# EAGLE schematic WB-v2.0b (EAGLE 6.1)

## Sheet 1 of 5
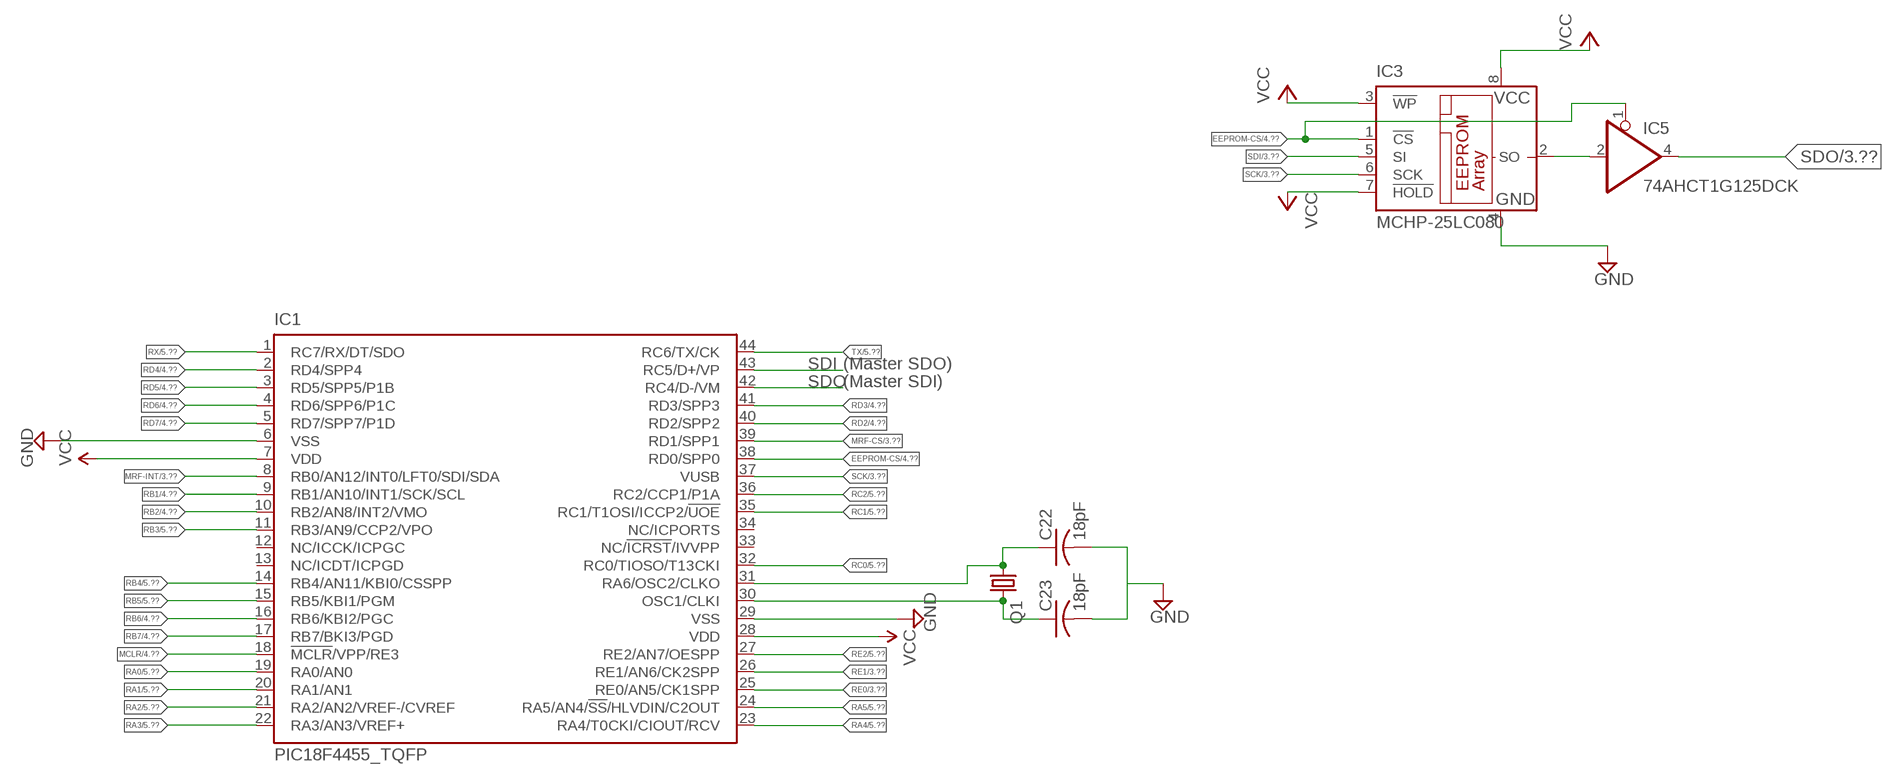
[diagram p0: schematic, sheet 1]

### Parts
C22  18pF  C-USC0402  [C0402]
C23  18pF  C-USC0402  [C0402]
IC1  PIC18F4455_TQFP  [TQFP44]
IC3  MCHP-25LC080  25AA080SN  [SO-08]
IC5  74AHCT1G125DCK  [SC70-5]
Q1  CRYSTALSM49  [SM49]

### Nets
EEPROM-CS: IC1.38(RD0/SPP0) IC3.1(!CS) IC5.1(OE) ; also sheet 4
GND: C22.2 C23.2 IC1.6(VSS) IC1.29(VSS) IC3.4(GND) ; also sheet 3,4,5
MCLR: IC1.18(!MCLR!/VPP/RE3) ; also sheet 4,5
MRF-CS: IC1.39(RD1/SPP1) ; also sheet 3,4
MRF-INT: IC1.8(RB0/AN12/INT0/LFT0/SDI/SDA) ; also sheet 3
N$11: IC3.2(SO) IC5.2(I)
N$12: C23.1 IC1.30(OSC1/CLKI) Q1.2
N$13: C22.1 IC1.31(RA6/OSC2/CLKO) Q1.1
RA0: IC1.19(RA0/AN0) ; also sheet 5
RA1: IC1.20(RA1/AN1) ; also sheet 5
RA2: IC1.21(RA2/AN2/VREF-/CVREF) ; also sheet 5
RA3: IC1.22(RA3/AN3/VREF+) ; also sheet 5
RA4: IC1.23(RA4/T0CKI/CIOUT/RCV) ; also sheet 5
RA5: IC1.24(RA5/AN4/!SS!/HLVDIN/C2OUT) ; also sheet 5
RB1: IC1.9(RB1/AN10/INT1/SCK/SCL) ; also sheet 4,5
RB2: IC1.10(RB2/AN8/INT2/VMO) ; also sheet 4,5
RB3: IC1.11(RB3/AN9/CCP2/VPO) ; also sheet 5
RB4: IC1.14(RB4/AN11/KBI0/CSSPP) ; also sheet 5
RB5: IC1.15(RB5/KBI1/PGM) ; also sheet 5
RB6: IC1.16(RB6/KBI2/PGC) ; also sheet 4,5
RB7: IC1.17(RB7/BKI3/PGD) ; also sheet 4,5
RC0: IC1.32(RC0/TIOSO/T13CKI) ; also sheet 5
RC1: IC1.35(RC1/T1OSI/ICCP2/!UOE) ; also sheet 5
RC2: IC1.36(RC2/CCP1/P1A) ; also sheet 5
RD2: IC1.40(RD2/SPP2) ; also sheet 4,5
RD3: IC1.41(RD3/SPP3) ; also sheet 4,5
RD4: IC1.2(RD4/SPP4) ; also sheet 4,5
RD5: IC1.3(RD5/SPP5/P1B) ; also sheet 4,5
RD6: IC1.4(RD6/SPP6/P1C) ; also sheet 4,5
RD7: IC1.5(RD7/SPP7/P1D) ; also sheet 4,5
RE0: IC1.25(RE0/AN5/CK1SPP) ; also sheet 3,5
RE1: IC1.26(RE1/AN6/CK2SPP) ; also sheet 3,5
RE2: IC1.27(RE2/AN7/OESPP) ; also sheet 5
RX: IC1.1(RC7/RX/DT/SDO) ; also sheet 5
SCK: IC1.37(VUSB) IC3.6(SCK) ; also sheet 3,4
SDI: IC1.43(RC5/D+/VP) IC3.5(SI) ; also sheet 3,4
SDO: IC1.42(RC4/D-/VM) IC5.4(O) ; also sheet 3,4
TX: IC1.44(RC6/TX/CK) ; also sheet 5
VCC: IC1.7(VDD) IC1.28(VDD) IC3.3(!WP) IC3.7(!HOLD) IC3.8(VCC) ; also sheet 3,4,5
Unconnected: IC1.12(NC/ICCK/ICPGC) IC1.13(NC/ICDT/ICPGD) IC1.33(NC/!ICRST!/IVVPP) IC1.34(NC/ICPORTS)

### Notes on the sheet
- (Master SDO)
- (Master SDI)

## Sheet 2 of 5
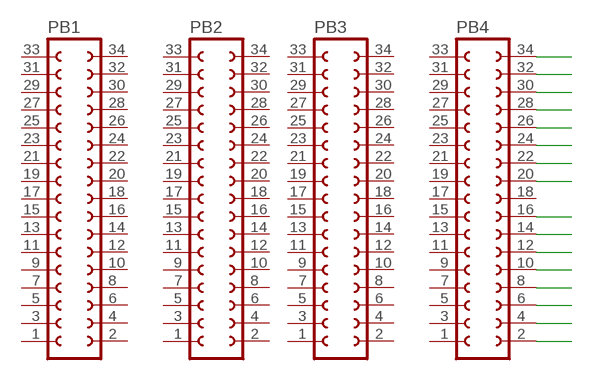
[diagram p1: schematic, sheet 2]

### Parts
PB1  FE17-2  [FE17-2]
PB2  FE17-2  [FE17-2]
PB3  FE17-2  [FE17-2]
PB4  FE17-2  [FE17-2]

### Nets
N$31: PB4.34
N$32: PB4.32
N$33: PB4.30
N$34: PB4.28
N$35: PB4.26
N$36: PB4.24
N$37: PB4.22
N$38: PB4.20
N$39: PB4.2
N$40: PB4.4
N$41: PB4.6
N$42: PB4.8
N$43: PB4.10
N$44: PB4.12
N$45: PB4.14
N$46: PB4.16
Unconnected: PB1.1 PB1.2 PB1.3 PB1.4 PB1.5 PB1.6 PB1.7 PB1.8 PB1.9 PB1.10 PB1.11 PB1.12 PB1.13 PB1.14 PB1.15 PB1.16 PB1.17 PB1.18 PB1.19 PB1.20 PB1.21 PB1.22 PB1.23 PB1.24 PB1.25 PB1.26 PB1.27 PB1.28 PB1.29 PB1.30 PB1.31 PB1.32 PB1.33 PB1.34 PB2.1 PB2.2 PB2.3 PB2.4 PB2.5 PB2.6 PB2.7 PB2.8 PB2.9 PB2.10 PB2.11 PB2.12 PB2.13 PB2.14 PB2.15 PB2.16 PB2.17 PB2.18 PB2.19 PB2.20 PB2.21 PB2.22 PB2.23 PB2.24 PB2.25 PB2.26 PB2.27 PB2.28 PB2.29 PB2.30 PB2.31 PB2.32 PB2.33 PB2.34 PB3.1 PB3.2 PB3.3 PB3.4 PB3.5 PB3.6 PB3.7 PB3.8 PB3.9 PB3.10 PB3.11 PB3.12 PB3.13 PB3.14 PB3.15 PB3.16 PB3.17 PB3.18 PB3.19 PB3.20 PB3.21 PB3.22 PB3.23 PB3.24 PB3.25 PB3.26 PB3.27 PB3.28 PB3.29 PB3.30 PB3.31 PB3.32 PB3.33 PB3.34 PB4.1 PB4.3 PB4.5 PB4.7 PB4.9 PB4.11 PB4.13 PB4.15 PB4.17 PB4.18 PB4.19 PB4.21 PB4.23 PB4.25 PB4.27 PB4.29 PB4.31 PB4.33

## Sheet 3 of 5
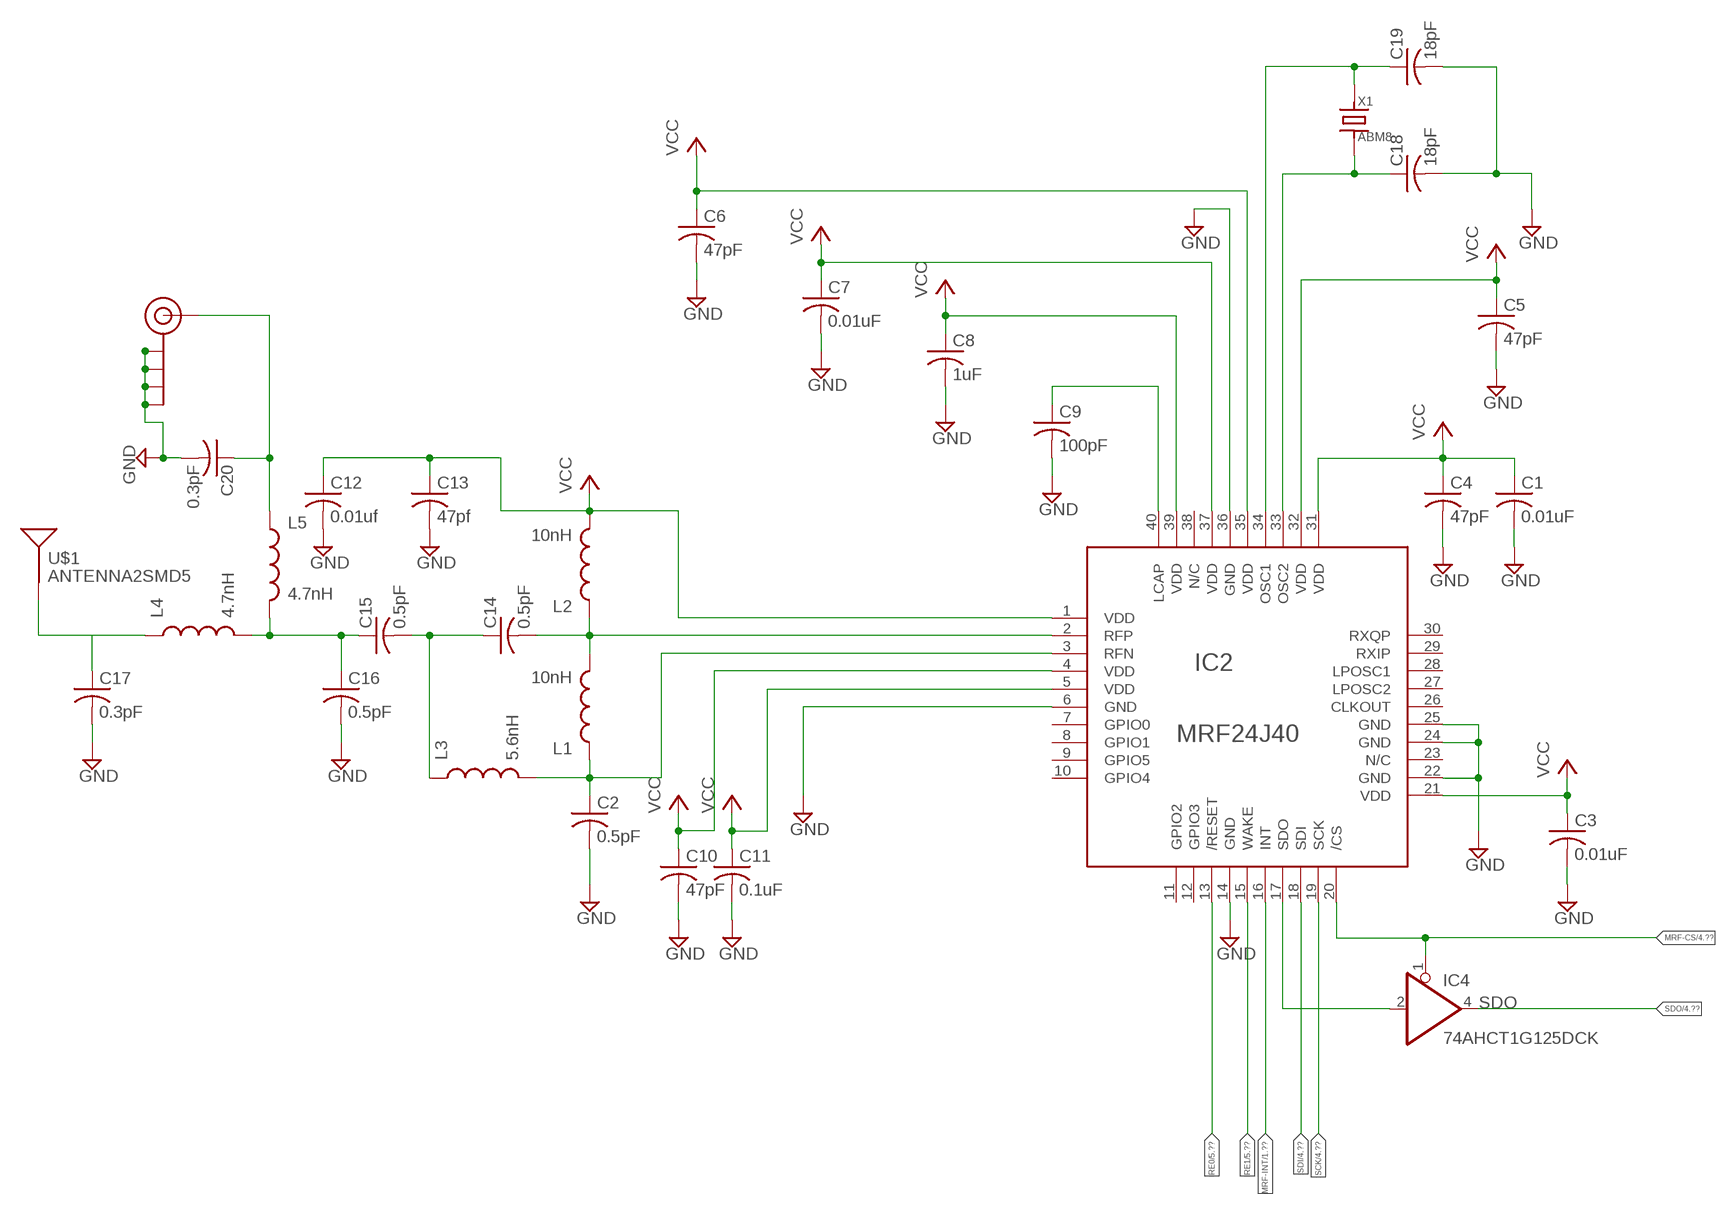
[diagram p2: schematic, sheet 3]

### Parts
C1  0.01uF  C-USC0402  [C0402]
C2  0.5pF  C-USC0402  [C0402]
C3  0.01uF  C-USC0402  [C0402]
C4  47pF  C-USC0402  [C0402]
C5  47pF  C-USC0402  [C0402]
C6  47pF  C-USC0402  [C0402]
C7  0.01uF  C-USC0402  [C0402]
C8  1uF  C-USC0402  [C0402]
C9  100pF  C-USC0402  [C0402]
C10  47pF  C-USC0402  [C0402]
C11  0.1uF  C-USC0402  [C0402]
C12  0.01uf  C-USC0402  [C0402]
C13  47pf  C-USC0402  [C0402]
C14  0.5pF  C-USC0402  [C0402]
C15  0.5pF  C-USC0402  [C0402]
C16  0.5pF  C-USC0402  [C0402]
C17  0.3pF  C-USC0402  [C0402]
C18  18pF  C-USC0402  [C0402]
C19  18pF  C-USC0402  [C0402]
C20  0.3pF  C-USC0402  [C0402]
IC2  MRF24J40  [QFN40]
IC4  74AHCT1G125DCK  [SC70-5]
J$1  SMA_EDGE  [SMA-EDGE]
L1  10nH  INDUCTOR0402  [C0402]
L2  10nH  INDUCTOR0402  [C0402]
L3  5.6nH  INDUCTOR0402  [C0402]
L4  4.7nH  INDUCTOR0402  [C0402]
L5  4.7nH  INDUCTOR0402  [C0402]
U$1  ANTENNA2SMD5  [ANTENNA-CHIP5]
X1  ABM8  [ABM8]

### Nets
GND: C1.2 C2.2 C3.2 C4.2 C5.2 C6.2 C7.2 C8.2 C9.2 C10.2 C11.2 C12.2 C13.2 C16.2 C17.2 C18.2 C19.2 C20.2 IC2.6(GND) IC2.14(GND) IC2.22(GND) IC2.24(GND) IC2.25(GND) IC2.36(GND) J$1.GND@0(GND) J$1.GND@1(GND) J$1.GND@2(GND) J$1.GND@3(GND) ; also sheet 1,4,5
MRF-CS: IC2.20(/CS) IC4.1(OE) ; also sheet 1,4
MRF-INT: IC2.16(INT) ; also sheet 1
N$1: C14.1 C15.2 L3.1
N$2: C2.1 IC2.3(RFN) L1.1 L3.2
N$3: C14.2 IC2.2(RFP) L1.2 L2.1
N$4: C15.1 C16.1 L4.2 L5.2
N$5: C17.1 L4.1 U$1.FEED(SIGNAL)
N$6: C9.1 IC2.40(LCAP)
N$7: C18.1 IC2.33(OSC2) X1.P$1
N$8: C19.1 IC2.34(OSC1) X1.P$3
N$9: C20.1 J$1.SIG(SIGNAL) L5.1
N$10: IC2.17(SDO) IC4.2(I)
RE0: IC2.13(/RESET) ; also sheet 1,5
RE1: IC2.15(WAKE) ; also sheet 1,5
SCK: IC2.19(SCK) ; also sheet 1,4
SDI: IC2.18(SDI) ; also sheet 1,4
SDO: IC4.4(O) ; also sheet 1,4
VCC: C1.1 C3.1 C4.1 C5.1 C6.1 C7.1 C8.1 C10.1 C11.1 C12.1 C13.1 IC2.1(VDD) IC2.4(VDD) IC2.5(VDD) IC2.21(VDD) IC2.31(VDD) IC2.32(VDD) IC2.35(VDD) IC2.37(VDD) IC2.39(VDD) L2.2 ; also sheet 1,4,5
Unconnected: IC2.7(GPIO0) IC2.8(GPIO1) IC2.9(GPIO5) IC2.10(GPIO4) IC2.11(GPIO2) IC2.12(GPIO3) IC2.23(N/C) IC2.26(CLKOUT) IC2.27(LPOSC2) IC2.28(LPOSC1) IC2.29(RXIP) IC2.30(RXQP) IC2.38(N/C)

## Sheet 4 of 5
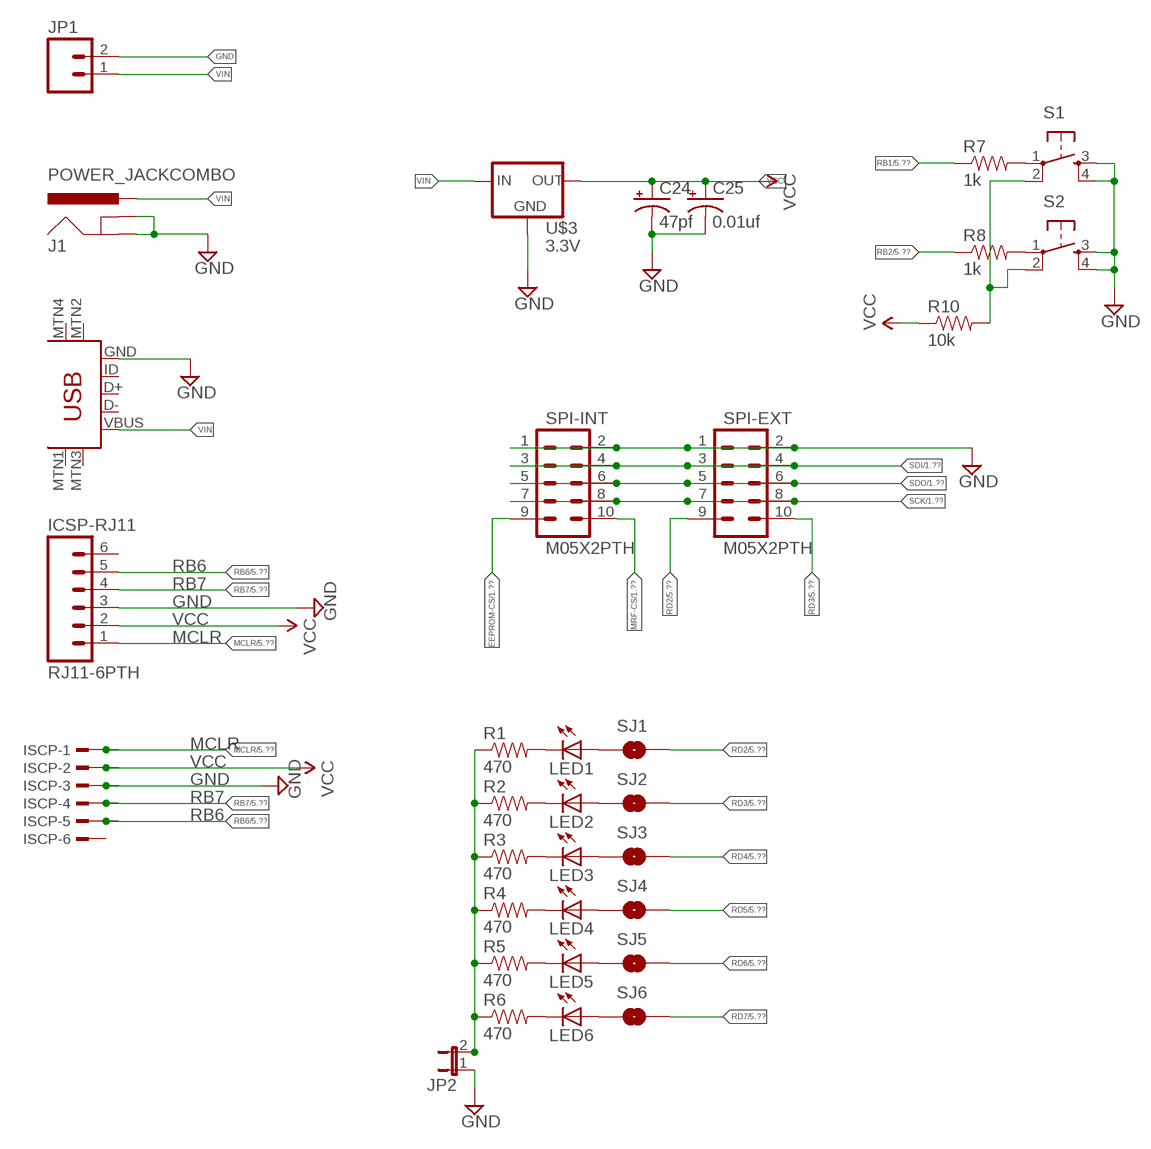
[diagram p3: schematic, sheet 4]

### Parts
C24  47pf  CAP_POLPTH2  [CPOL-RADIAL-10UF-25V]
C25  0.01uf  CAP_POLPTH2  [CPOL-RADIAL-10UF-25V]
ICSP-RJ11  RJ11-6PTH  [RJ11-6]
ISCP  TSW-106-02-S-S  [TSW-106-02-S-S]
J1  POWER_JACKCOMBO  [POWER_JACK_COMBO]
JP1  M02LOCK_LONGPADS  [1X02_LOCK_LONGPADS]
JP2  JUMPER-2PTH  [1X02]
LED1  LED0603  [LED-0603]
LED2  LED0603  [LED-0603]
LED3  LED0603  [LED-0603]
LED4  LED0603  [LED-0603]
LED5  LED0603  [LED-0603]
LED6  LED0603  [LED-0603]
R1  470  RESISTOR0603-RES  [0603-RES]
R2  470  RESISTOR0603-RES  [0603-RES]
R3  470  RESISTOR0603-RES  [0603-RES]
R4  470  RESISTOR0603-RES  [0603-RES]
R5  470  RESISTOR0603-RES  [0603-RES]
R6  470  RESISTOR0603-RES  [0603-RES]
R7  1k  RESISTOR0603-RES  [0603-RES]
R8  1k  RESISTOR0603-RES  [0603-RES]
R10  10k  RESISTOR0603-RES  [0603-RES]
S1  TAC_SWITCHPTH  [TACTILE-PTH]
S2  TAC_SWITCHPTH  [TACTILE-PTH]
SJ1  SOLDERJUMPERTRACE  [SJ_2S-TRACE]
SJ2  SOLDERJUMPERTRACE  [SJ_2S-TRACE]
SJ3  SOLDERJUMPERTRACE  [SJ_2S-TRACE]
SJ4  SOLDERJUMPERTRACE  [SJ_2S-TRACE]
SJ5  SOLDERJUMPERTRACE  [SJ_2S-TRACE]
SJ6  SOLDERJUMPERTRACE  [SJ_2S-TRACE]
SPI-EXT  M05X2PTH  [AVR_ICSP]
SPI-INT  M05X2PTH  [AVR_ICSP]
U$2  USB-MINIB-5PIN  [USB-MINIB]
U$3  3.3V  V_REG_LD1117VXX  [78XXL]

### Nets
EEPROM-CS: SPI-INT.9 ; also sheet 1
GND: C24.2(-) C25.2(-) ICSP-RJ11.3 ISCP.3 J1.GND(GNDBREAK) J1.GND@1(GND) JP1.2 JP2.1 S1.3 S1.4 S2.3 S2.4 SPI-EXT.1 SPI-EXT.2 SPI-INT.1 SPI-INT.2 U$2.GND U$3.IN(GND) ; also sheet 1,3,5
MCLR: ICSP-RJ11.1 ISCP.1 ; also sheet 1,5
MRF-CS: SPI-INT.10 ; also sheet 1,3
N$14: LED1.C R1.2
N$15: LED2.C R2.2
N$16: LED3.C R3.2
N$17: LED4.C R4.2
N$18: LED5.C R5.2
N$19: LED6.C R6.2
N$20: R7.2 S1.1
N$21: R10.2 S1.2 S2.2
N$22: LED1.A SJ1.1
N$23: LED3.A SJ3.1
N$24: LED4.A SJ4.1
N$25: LED5.A SJ5.1
N$26: LED6.A SJ6.1
N$27: R8.2 S2.1
N$29: LED2.A SJ2.1
N$30: JP2.2 R1.1 R2.1 R3.1 R4.1 R5.1 R6.1
RB1: R7.1 ; also sheet 1,5
RB2: R8.1 ; also sheet 1,5
RB6: ICSP-RJ11.5 ISCP.5 ; also sheet 1,5
RB7: ICSP-RJ11.4 ISCP.4 ; also sheet 1,5
RD2: SJ1.2 SPI-EXT.9 ; also sheet 1,5
RD3: SJ2.2 SPI-EXT.10 ; also sheet 1,5
RD4: SJ3.2 ; also sheet 1,5
RD5: SJ4.2 ; also sheet 1,5
RD6: SJ5.2 ; also sheet 1,5
RD7: SJ6.2 ; also sheet 1,5
SCK: SPI-EXT.7 SPI-EXT.8 SPI-INT.7 SPI-INT.8 ; also sheet 1,3
SDI: SPI-EXT.3 SPI-EXT.4 SPI-INT.3 SPI-INT.4 ; also sheet 1,3
SDO: SPI-EXT.5 SPI-EXT.6 SPI-INT.5 SPI-INT.6 ; also sheet 1,3
VCC: C24.1(+) C25.1(+) ICSP-RJ11.2 ISCP.2 R10.1 U$3.GND(OUT) ; also sheet 1,3,5
VIN: J1.POWER(PWR) JP1.1 U$2.VBUS U$3.OUT(IN)
Unconnected: ICSP-RJ11.6 ISCP.6 U$2.D+ U$2.D- U$2.ID U$2.MTN1(MTN2) U$2.MTN2(MTN3) U$2.MTN3(MTN1) U$2.MTN4

## Sheet 5 of 5
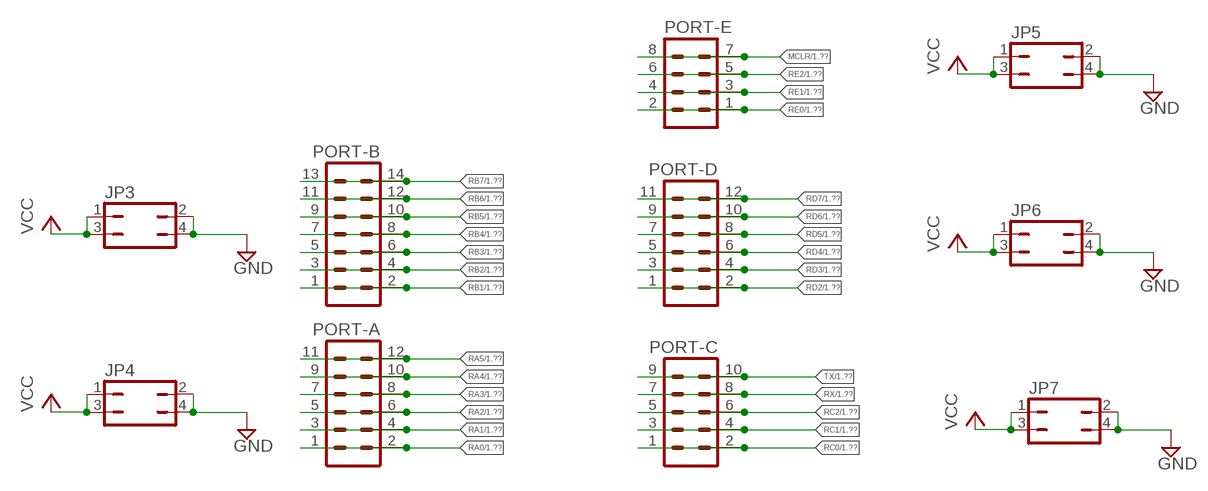
[diagram p4: schematic, sheet 5]

### Parts
JP3  JP2Q  [JP2Q]
JP4  JP2Q  [JP2Q]
JP5  JP2Q  [JP2Q]
JP6  JP2Q  [JP2Q]
JP7  JP2Q  [JP2Q]
PORT-A  MA06-2  [MA06-2]
PORT-B  MA07-2  [MA07-2]
PORT-C  MA05-2  [MA05-2]
PORT-D  MA06-2  [MA06-2]
PORT-E  MA04-2  [MA04-2]

### Nets
GND: JP3.2 JP3.4 JP4.2 JP4.4 JP5.2 JP5.4 JP6.2 JP6.4 JP7.2 JP7.4 ; also sheet 1,3,4
MCLR: PORT-E.7 PORT-E.8 ; also sheet 1,4
RA0: PORT-A.1 PORT-A.2 ; also sheet 1
RA1: PORT-A.3 PORT-A.4 ; also sheet 1
RA2: PORT-A.5 PORT-A.6 ; also sheet 1
RA3: PORT-A.7 PORT-A.8 ; also sheet 1
RA4: PORT-A.9 PORT-A.10 ; also sheet 1
RA5: PORT-A.11 PORT-A.12 ; also sheet 1
RB1: PORT-B.1 PORT-B.2 ; also sheet 1,4
RB2: PORT-B.3 PORT-B.4 ; also sheet 1,4
RB3: PORT-B.5 PORT-B.6 ; also sheet 1
RB4: PORT-B.7 PORT-B.8 ; also sheet 1
RB5: PORT-B.9 PORT-B.10 ; also sheet 1
RB6: PORT-B.11 PORT-B.12 ; also sheet 1,4
RB7: PORT-B.13 PORT-B.14 ; also sheet 1,4
RC0: PORT-C.1 PORT-C.2 ; also sheet 1
RC1: PORT-C.3 PORT-C.4 ; also sheet 1
RC2: PORT-C.5 PORT-C.6 ; also sheet 1
RD2: PORT-D.1 PORT-D.2 ; also sheet 1,4
RD3: PORT-D.3 PORT-D.4 ; also sheet 1,4
RD4: PORT-D.5 PORT-D.6 ; also sheet 1,4
RD5: PORT-D.7 PORT-D.8 ; also sheet 1,4
RD6: PORT-D.9 PORT-D.10 ; also sheet 1,4
RD7: PORT-D.11 PORT-D.12 ; also sheet 1,4
RE0: PORT-E.1 PORT-E.2 ; also sheet 1,3
RE1: PORT-E.3 PORT-E.4 ; also sheet 1,3
RE2: PORT-E.5 PORT-E.6 ; also sheet 1
RX: PORT-C.7 PORT-C.8 ; also sheet 1
TX: PORT-C.9 PORT-C.10 ; also sheet 1
VCC: JP3.1 JP3.3 JP4.1 JP4.3 JP5.1 JP5.3 JP6.1 JP6.3 JP7.1 JP7.3 ; also sheet 1,3,4

## Power pins joined to a net without a drawn wire
GND: IC4.3(GND) IC5.3(GND) X1.P$2(GND) X1.P$4(GND)
VCC: IC4.5(VCC) IC5.5(VCC)

## Library data of the parts
C1-C20 C22 C23 = ZPRIDDY:C-US: CAPACITOR, American symbol
C24 C25 = SparkFun:CAP_POL: Capacitor Polarized These are standard SMD and PTH capacitors. Normally 10uF, 47uF, and 100uF in electrolytic and tantalum varieties. Always verify the external diameter of the through hole cap, it varies with capacity, voltage, and manufacturer. The EIA devices should be standard.
IC1 = microchip:PIC18F4*_TQFP: USB Microcontrollers with nanoWatt Technology High-Performance, Enhanced Flash, 28/40/44-Pin, Source: http://ww1.microchip.com/downloads/en/devicedoc/39632c.pdf; MF: MICROCHIP; MPN: PIC18F4455-I/PT; OC_FARNELL: 9321322; OC_NEWARK: 08J9628
IC2 = mrf24j40:MRF24J40: MRF24J40 - ZigBee RF Transceiver
IC3 = microchip:25*: Serial EEPROM 4K/ 8K , SPI bus; MF: MICROCHIP; MPN: 25AA080/SN; OC_FARNELL: 1816072; OC_NEWARK: 92C7351
IC4 IC5 = 74xx-little-de:74*1G125: Single Bus Buffer Gate with 3-State Output
ICSP-RJ11 = SparkFun:RJ11-6: RJ11 Jack Simple 6 pin RJ11 jack. Commonly found on CAT3 devices and Microchip programmers. SKU: PRT-00132
ISCP = con-samtec:TSW-106-02-S-S: THROUGH-HOLE .025" SQ POST HEADER Source: Samtec TSW.pdf; OC_FARNELL: unknown; OC_NEWARK: unknown
J1 = SparkFun:POWER_JACK: Power Jack This is the standard 5.5mm barrel jack for power. The PTH is the most common, proven, reliable, footprint. All others are experimental. The Slot footprint only works if the mill layer is transmitted to the PCB fab house so be warned. Spark Fun Electronics SKU : PRT-00119. Mating wall wart : TOL-00298 (and others)
J$1 = SparkFun:SMA_EDGE: SMA Antenna Connector End launch SMA connector. The paste layer has been removed so that the connector can be hand soldered onto the board after reflow.
JP1 = SparkFun:M02: Header 2 Standard 2-pin 0.1" header. Use with straight break away headers (SKU : PRT-00116), right angle break away headers (PRT-00553), swiss pins (PRT-00743), machine pins (PRT-00117), and female headers (PRT-00115). Molex polarized connector foot print use with SKU : PRT-08233 with associated crimp pins and housings.
JP2 = SparkFun:JUMPER-2: Jumper Basic 0.1" spaced jumper. Use with breakaway headers.
JP3-JP7 = jumper:JP2Q: JUMPER
L1-L5 = SparkFun:INDUCTOR: Inductors Basic Inductor/Choke - 0603 and 1206. Footprints are not proven and vary greatly between part numbers.
LED1-LED6 = SparkFun:LED: LEDs Standard schematic elements and footprints for 5mm, 3mm, 1206, and 0603 sized LEDs. 5mm - Spark Fun Electronics SKU : COM-00529 (and others)
PB1-PB4 = con-lsta:FE17-2: FEMALE HEADER; OC_FARNELL: unknown; OC_NEWARK: unknown
PORT-A PORT-D = con-lstb:MA06-2: PIN HEADER; OC_FARNELL: unknown; OC_NEWARK: unknown
PORT-B = con-lstb:MA07-2: PIN HEADER; OC_FARNELL: unknown; OC_NEWARK: unknown
PORT-C = con-lstb:MA05-2: PIN HEADER; OC_FARNELL: unknown; OC_NEWARK: unknown
PORT-E = con-lstb:MA04-2: PIN HEADER; OC_FARNELL: unknown; OC_NEWARK: unknown
Q1 = crystal:CRYSTAL: CRYSTAL; OC_FARNELL: unknown; OC_NEWARK: unknown
R1-R8 R10 = SparkFun:RESISTOR: Resistor Basic schematic elements and footprints for 0603, 1206, and PTH resistors.
S1 S2 = SparkFun:TAC_SWITCH: Momentary Switch Button commonly used for reset or general input. Spark Fun Electronics SKU : COM-00097
SJ1-SJ6 = SparkFun:SOLDERJUMPER: Solder Jumper Standard SMD solder jumper. Used to automate production. Two varients : Normally Open and Normally Closed are the same, but have different paste layers. NC will have a large amount of paste and should jumper during reflow.
SPI-EXT SPI-INT = SparkFun:M05X2: Header 5x2 Standard 10-pin dual row 0.1" header. Commonly used with AVR-ISP. Use with Spark Fun Electronics SKU: PRT-00778
U$1 = SparkFun:ANTENNA2: Antenna Single endded antenna. Common with smaller chip antennas. CHIP4 package is the GPS Chip Antenna SKU: GPS-08418. CHIP5 package is 2.4GHz chip antenna SKU: WRL-00144.
U$2 = SparkFun:USB-MINIB: Mini-USB "B" connector with 5th pin broken out. Created new symbol breaking out 5th "ID" pin in mini/micro USB connector spec. See: http://en.wikipedia.org/wiki/Mini_usb#Cables. Uses same footprint as 4-pin symbol. Also added pins to connect to mounting / shield pads if required (probably not generally needed as signals aren't shielded once they leave the connector).
U$3 = SparkFun:V_REG_LD1117VXX: LD1117VXX voltage regulator. We carry the 3.3V version (COM-00526) in TO-220 package.
X1 = ZPRIDDY:ABM8